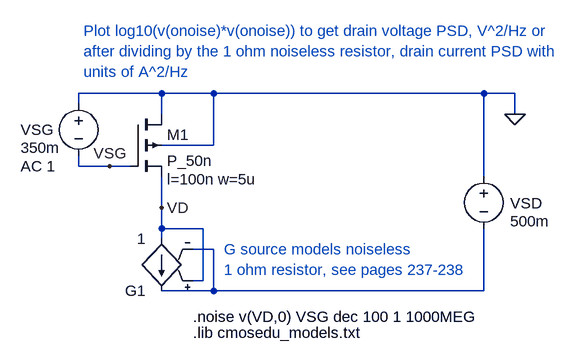
[diagram p0: schematic NOISE_PMOS_50n.asc]
NOISE_PMOS_50n.asc, the LTspice schematic file:
Version 4
SHEET 1 1520 688
WIRE 448 80 320 80
WIRE 528 80 448 80
WIRE 944 80 528 80
WIRE 992 80 944 80
WIRE 320 96 320 80
WIRE 448 112 448 80
WIRE 992 112 992 80
WIRE 528 160 528 80
WIRE 528 160 448 160
WIRE 320 192 320 176
WIRE 368 192 320 192
WIRE 400 192 368 192
WIRE 944 208 944 80
WIRE 448 256 448 208
WIRE 448 288 448 256
WIRE 512 288 448 288
WIRE 448 304 448 288
WIRE 528 320 496 320
WIRE 512 368 512 288
WIRE 512 368 496 368
WIRE 528 384 528 320
WIRE 528 384 448 384
WIRE 944 384 944 288
WIRE 944 384 528 384
FLAG 992 112 0
FLAG 368 192 VSG
FLAG 448 256 VD
SYMBOL voltage 320 80 R0
WINDOW 0 -89 56 Left 0
WINDOW 3 -89 84 Left 0
WINDOW 123 -89 112 Left 0
WINDOW 39 0 0 Left 0
SYMATTR InstName VSG
SYMATTR Value 350m
SYMATTR Value2 AC 1
SYMBOL voltage 944 192 R0
WINDOW 123 0 0 Left 0
WINDOW 39 0 0 Left 0
WINDOW 0 41 57 Left 0
WINDOW 3 41 85 Left 0
SYMATTR InstName VSD
SYMATTR Value 500m
SYMBOL pmos4 400 112 R0
WINDOW 123 56 100 Left 0
SYMATTR Value2 l=100n w=5u
SYMATTR InstName M1
SYMATTR Value P_50n
SYMBOL g 448 400 R180
SYMATTR InstName G1
SYMATTR Value 1
TEXT 496 424 Left 0 !.noise v(VD,0) VSG dec 100 1 1000MEG
TEXT 496 448 Left 0 !.lib cmosedu_models.txt
TEXT 328 -16 Left 0 ;Plot log10(v(onoise)*v(onoise)) to get drain voltage PSD, V^2/Hz or \nafter dividing by the 1 ohm noiseless resistor, drain current PSD with\nunits of A^2/Hz
TEXT 544 320 Left 0 ;G source models noiseless\n1 ohm resistor, see pages 237-238

The netlist it stands for:
* NOISE_PMOS_50n.asc
VSG 0 VSG 350m AC 1
VSD 0 N001 500m
M1 0 VSG VD 0 P_50n l=100n w=5u
G1 VD N001 VD N001 1
.model NMOS NMOS
.model PMOS PMOS
.lib standard.mos
.noise v(VD,0) VSG dec 100 1 1000MEG
.lib cmosedu_models.txt
* Plot log10(v(onoise)*v(onoise)) to get drain voltage PSD, V^2/Hz or
* after dividing by the 1 ohm noiseless resistor, drain current PSD with
* units of A^2/Hz
* G source models noiseless
* 1 ohm resistor, see pages 237-238
.backanno
.end